# Altium schematic sheet Ethernet Interface.SchDoc (part 3 of 3)
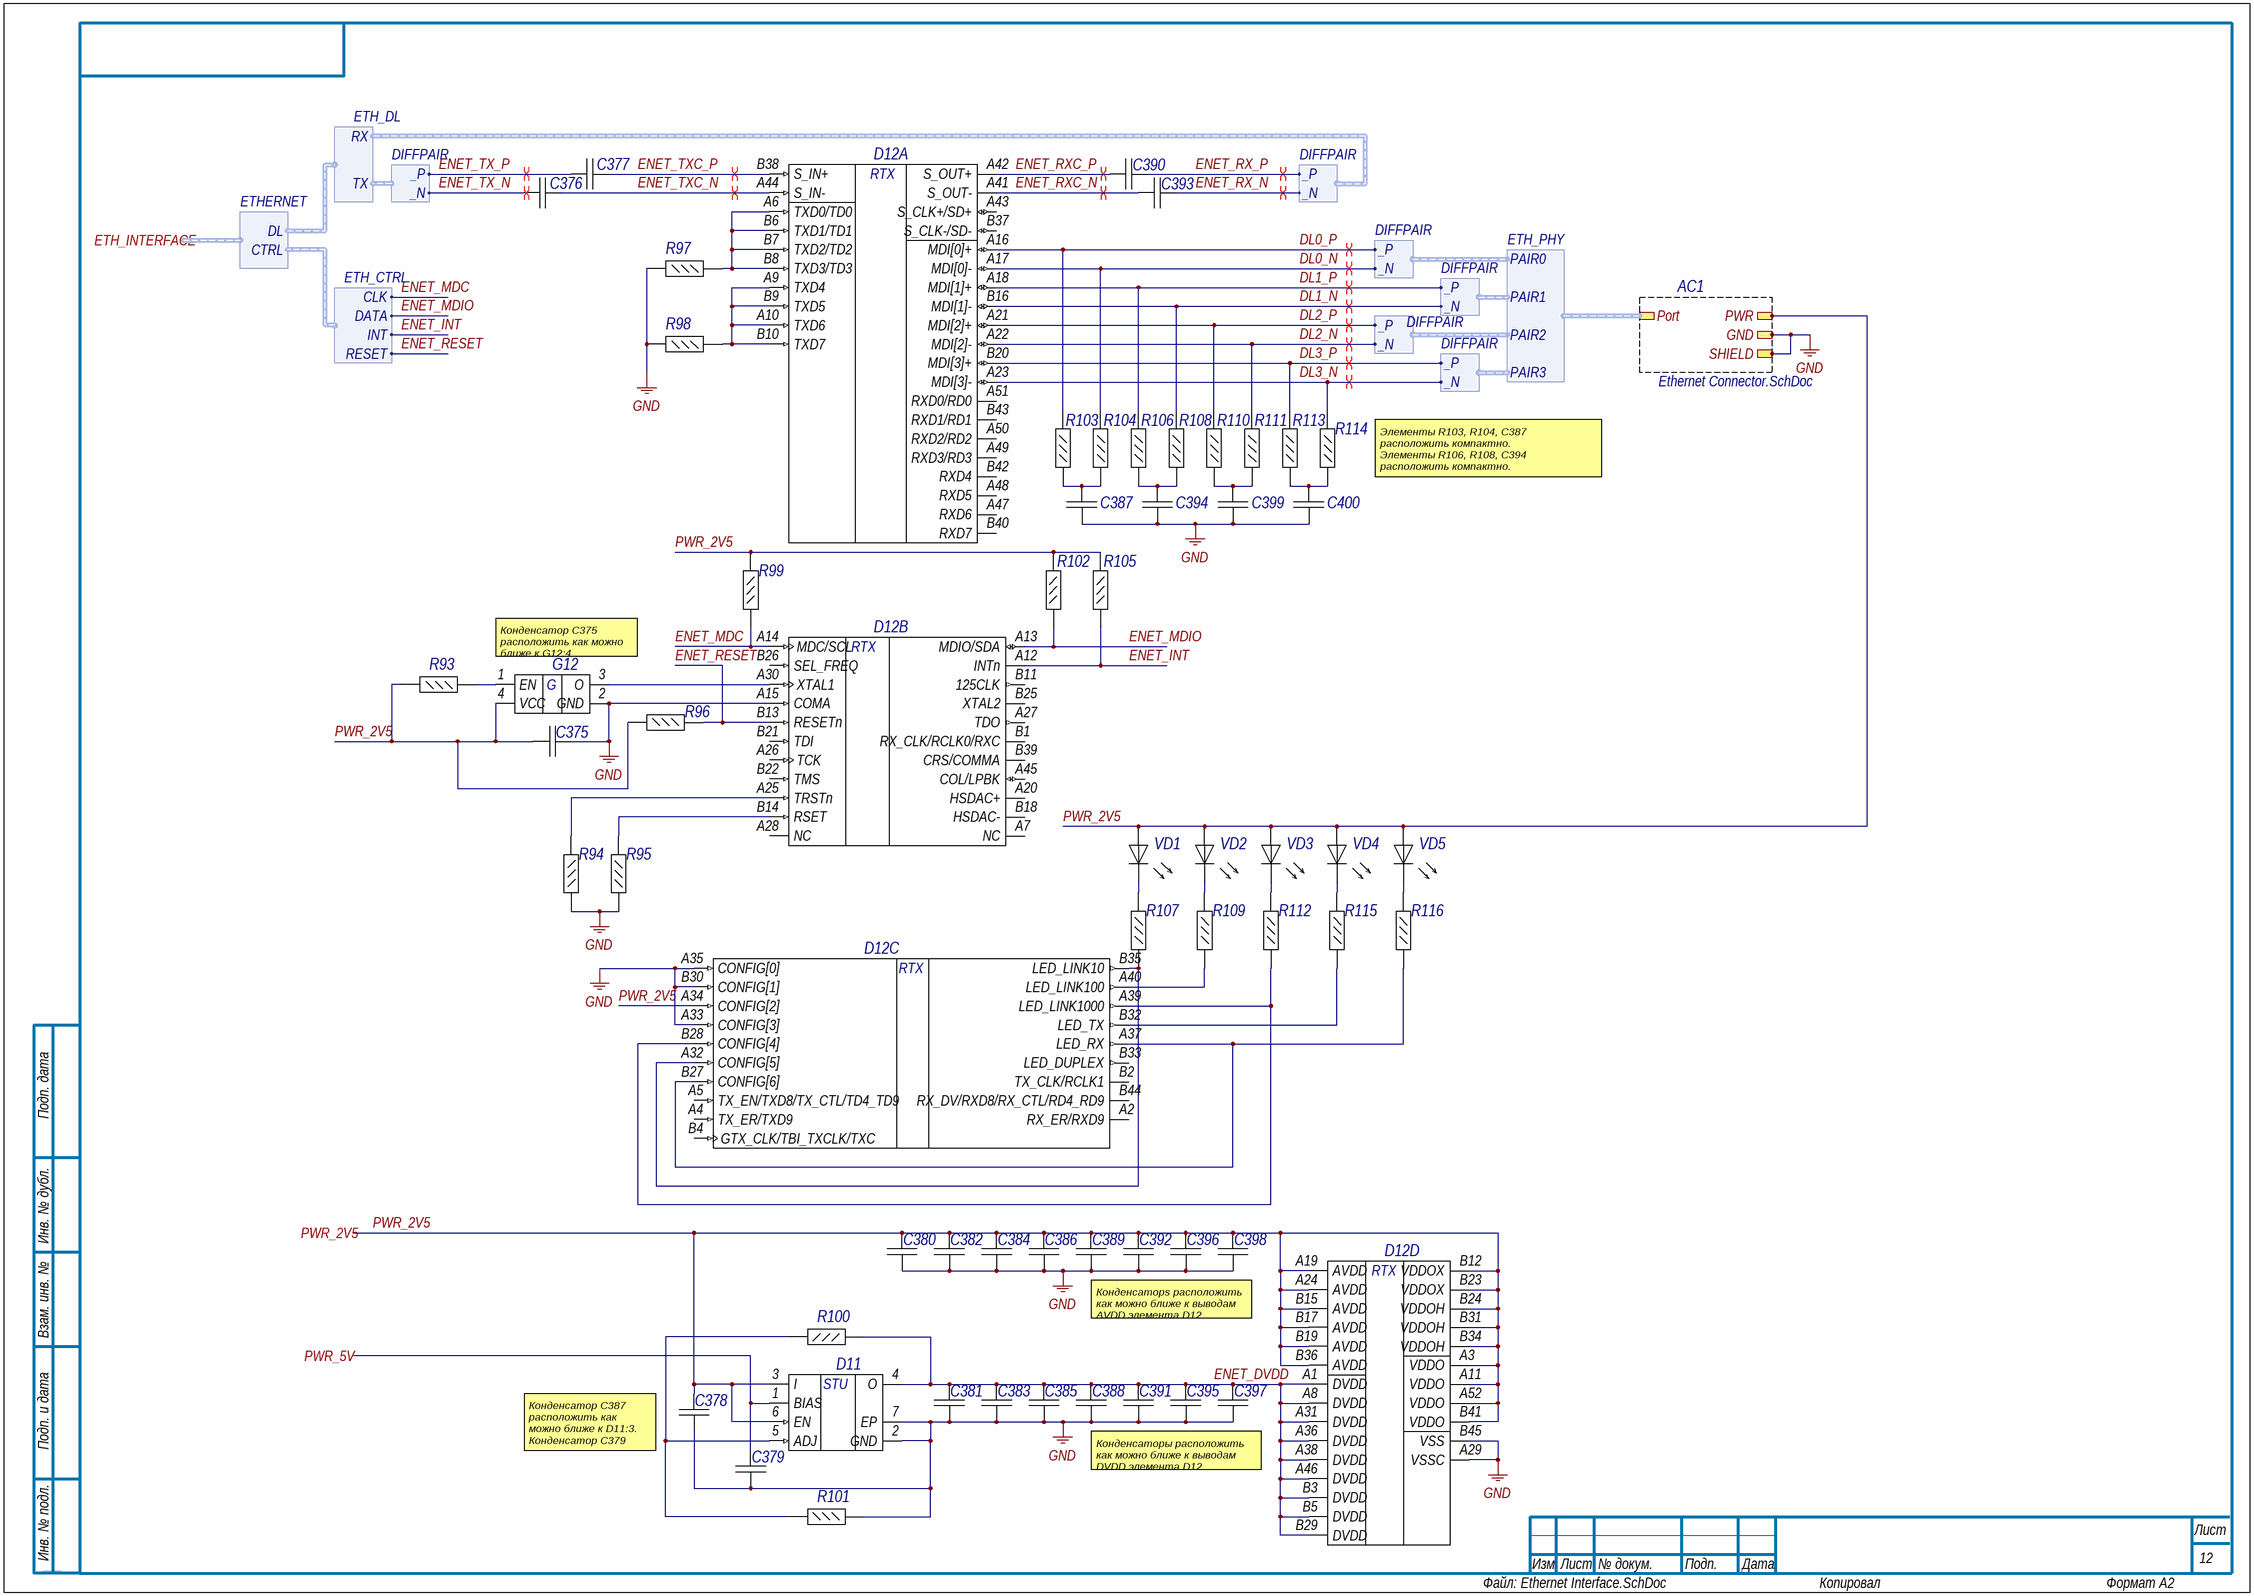
[diagram p2: Ethernet Interface.SchDoc]

## Library data of the parts (continued)
R115 = E95: Chip Resistor, 240 Ohm, +/- 1%, 100 mW, -55 to 155 degC, 0402 (1005 Metric), RoHS, Tape and Reel; Тип элемента: Резистор; Case\/Package: 0402; Voltage Rating: 50 V; Power Rating: 100 mW; Resistance: 240 Ohm; Old_des: R266; New_des: R134; UID: E95; Component Kind: Standard; Case Code (Imperial): 0402; Case Code (Metric): 1005; ComponentLink1Description: Manufacturer URL; ComponentLink1URL: http://www.panasonic.com/; ComponentLink2Description: Datasheet; ComponentLink2URL: http://industrial.panasonic.com/cdbs/www-data/pdf/RDA0000/AOA0000C86.pdf; DatasheetVersion: 04/2015; Length: 1 mm; Max Operating Temperature: 155 degC; Min Operating Temperature: -55 degC; Mounting Technology: Surface Mount; Package Quantity: 10000; PackageDescription: 2-Pin Surface Mount Device, Body 1 x 0.5 mm; Packaging: Tape and Reel; PartNumber: ERJ-2RKF2400X; RoHSCompliant: true; Tolerance: 1%; Width: 0.5 mm; Height: 0.35 mm; Mount: Surface Mount; PackageReference: 0402; Pins: 2; Radiation Hardening: No; REACH SVHC: Unknown
R116 = E95: Chip Resistor, 240 Ohm, +/- 1%, 100 mW, -55 to 155 degC, 0402 (1005 Metric), RoHS, Tape and Reel; Тип элемента: Резистор; Case\/Package: 0402; Voltage Rating: 50 V; Power Rating: 100 mW; Resistance: 240 Ohm; Old_des: R267; New_des: R135; UID: E95; Component Kind: Standard; Case Code (Imperial): 0402; Case Code (Metric): 1005; ComponentLink1Description: Manufacturer URL; ComponentLink1URL: http://www.panasonic.com/; ComponentLink2Description: Datasheet; ComponentLink2URL: http://industrial.panasonic.com/cdbs/www-data/pdf/RDA0000/AOA0000C86.pdf; DatasheetVersion: 04/2015; Length: 1 mm; Max Operating Temperature: 155 degC; Min Operating Temperature: -55 degC; Mounting Technology: Surface Mount; Package Quantity: 10000; PackageDescription: 2-Pin Surface Mount Device, Body 1 x 0.5 mm; Packaging: Tape and Reel; PartNumber: ERJ-2RKF2400X; RoHSCompliant: true; Tolerance: 1%; Width: 0.5 mm; Height: 0.35 mm; Mount: Surface Mount; PackageReference: 0402; Pins: 2; Radiation Hardening: No; REACH SVHC: Unknown
VD1 = E30: SMD mono-color Chip LED, WL-SMCW, Bright Green; Manufacturer: Wuerth Elektronik; Тип элемента: Светодиод; Old_des: D9; New_des: VD1; UID: E30; Component Kind: Standard; ComponentLink1Description: Manufacturer URL; ComponentLink1URL: http://www.we-online.com; ComponentLink2Description: Datasheet; ComponentLink2URL: http://katalog.we-online.com/led/datasheet/150060VS75000.pdf; PartNumber: 150060VS75000; PackageReference: 0603_A; Color: Bright Green
VD2 = E30: SMD mono-color Chip LED, WL-SMCW, Bright Green; Manufacturer: Wuerth Elektronik; Тип элемента: Светодиод; Old_des: D8; New_des: VD2; UID: E30; Component Kind: Standard; ComponentLink1Description: Manufacturer URL; ComponentLink1URL: http://www.we-online.com; ComponentLink2Description: Datasheet; ComponentLink2URL: http://katalog.we-online.com/led/datasheet/150060VS75000.pdf; PartNumber: 150060VS75000; PackageReference: 0603_A; Color: Bright Green
VD3 = E30: SMD mono-color Chip LED, WL-SMCW, Bright Green; Manufacturer: Wuerth Elektronik; Тип элемента: Светодиод; Old_des: D7; New_des: VD3; UID: E30; Component Kind: Standard; ComponentLink1Description: Manufacturer URL; ComponentLink1URL: http://www.we-online.com; ComponentLink2Description: Datasheet; ComponentLink2URL: http://katalog.we-online.com/led/datasheet/150060VS75000.pdf; PartNumber: 150060VS75000; PackageReference: 0603_A; Color: Bright Green
VD4 = E30: SMD mono-color Chip LED, WL-SMCW, Bright Green; Manufacturer: Wuerth Elektronik; Тип элемента: Светодиод; Old_des: D5; New_des: VD4; UID: E30; Component Kind: Standard; ComponentLink1Description: Manufacturer URL; ComponentLink1URL: http://www.we-online.com; ComponentLink2Description: Datasheet; ComponentLink2URL: http://katalog.we-online.com/led/datasheet/150060VS75000.pdf; PartNumber: 150060VS75000; PackageReference: 0603_A; Color: Bright Green
VD5 = E30: SMD mono-color Chip LED, WL-SMCW, Bright Green; Manufacturer: Wuerth Elektronik; Тип элемента: Светодиод; Old_des: D6; New_des: VD5; UID: E30; Component Kind: Standard; ComponentLink1Description: Manufacturer URL; ComponentLink1URL: http://www.we-online.com; ComponentLink2Description: Datasheet; ComponentLink2URL: http://katalog.we-online.com/led/datasheet/150060VS75000.pdf; PartNumber: 150060VS75000; PackageReference: 0603_A; Color: Bright Green